# EasyEDA Pro project remap_2025-11-01.epro

# Schematic remap
Board Name: remap; Create Date: 2025-10-31; Page Name: Sheet_1; Project Name: Makro; Schematic Name: remap; Update Date: 2025-10-31; File: Remapper; Id: /; Sheet: /
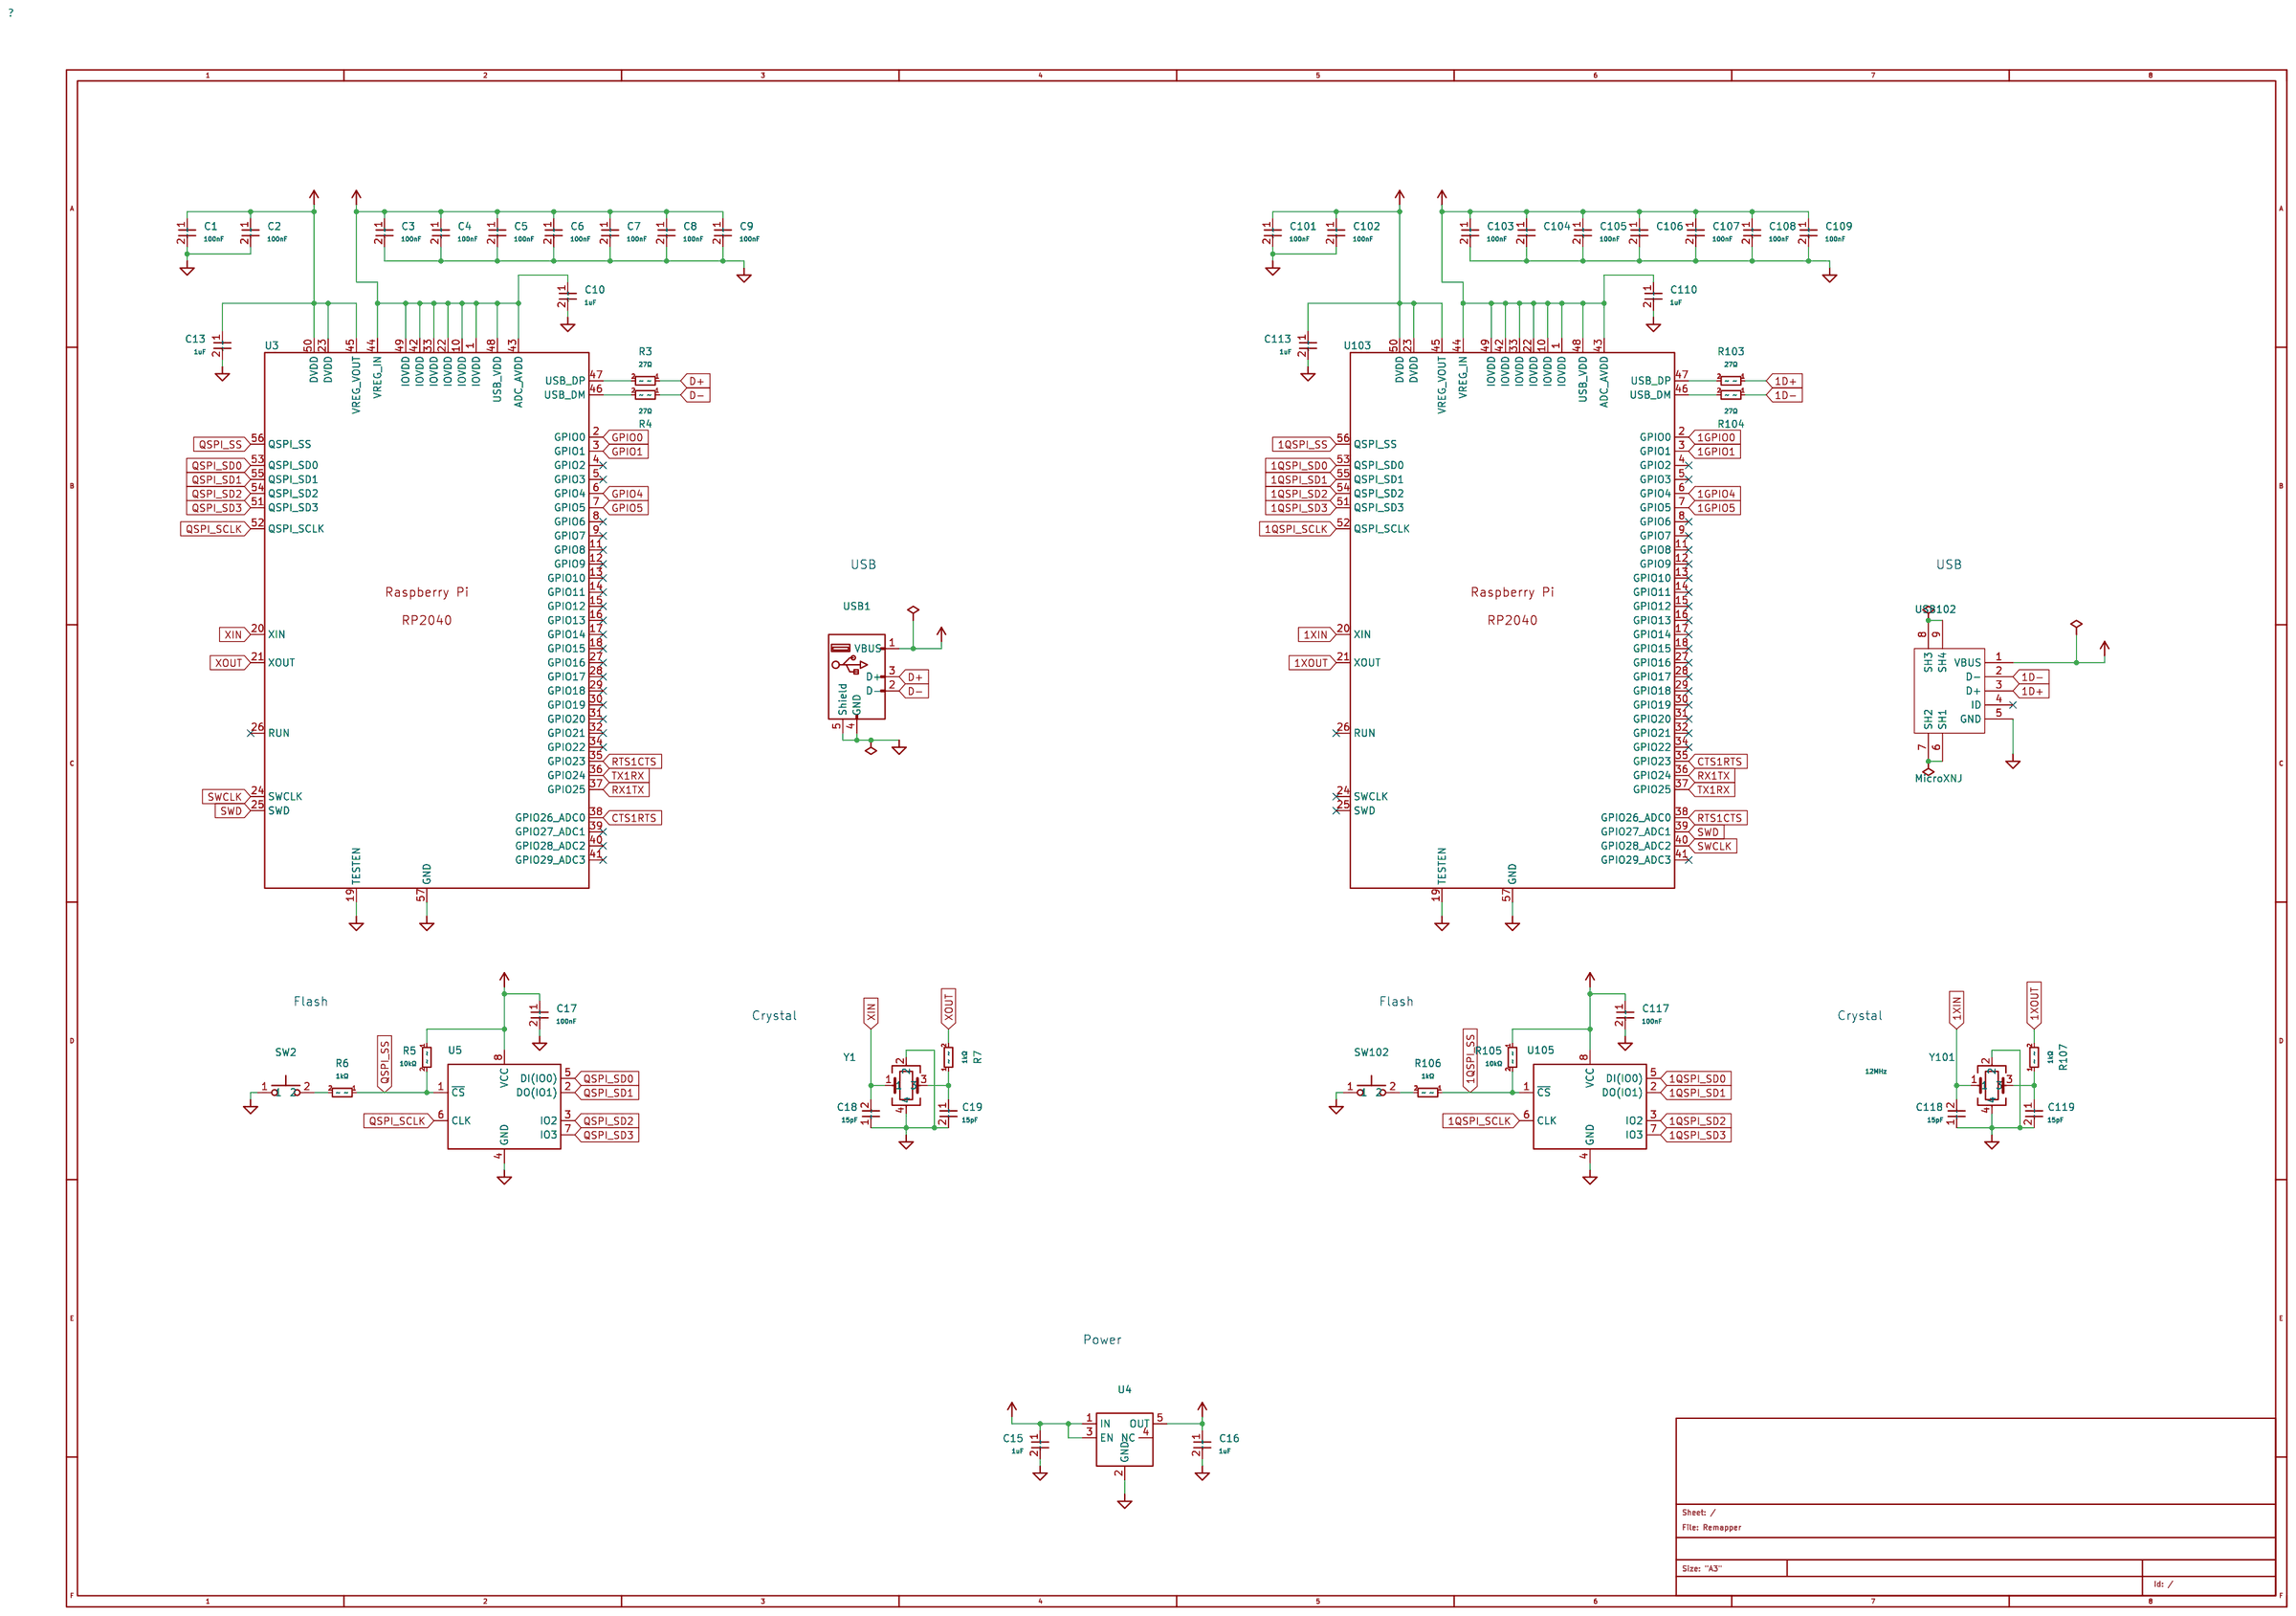
[diagram p0: schematic sheet]

## Parts
C1  100nF  [C0402]
C2  100nF  [C0402]
C3  100nF  [C0402]
C4  100nF  [C0402]
C5  100nF  [C0402]
C6  100nF  [C0402]
C7  100nF  [C0402]
C8  100nF  [C0402]
C9  100nF  [C0402]
C10  1uF  [C0402]
C13  1uF  [C0402]
C15  1uF  [C0402]
C16  1uF  [C0402]
C17  100nF  [C0402]
C18  15pF  [C0402]
C19  15pF  [C0402]
C101  100nF  [C0402]
C102  100nF  [C0402]
C103  100nF  [C0402]
C104  100nF  [C0402]
C105  100nF  [C0402]
C106  100nF  [C0402]
C107  100nF  [C0402]
C108  100nF  [C0402]
C109  100nF  [C0402]
C110  1uF  [C0402]
C113  1uF  [C0402]
C117  100nF  [C0402]
C118  15pF  [C0402]
C119  15pF  [C0402]
R3  27Ω  [R0402]
R4  27Ω  [R0402]
R5  10kΩ  [R0402]
R6  1kΩ  [R0402]
R7  1kΩ  [R0402]
R103  27Ω  [R0402]
R104  27Ω  [R0402]
R105  10kΩ  [R0402]
R106  1kΩ  [R0402]
R107  1kΩ  [R0402]
SW2  B3U-1000P  [KEY-SMD_B3U-1000PM]
SW102  B3U-1000P  [KEY-SMD_B3U-1000PM]
U3  RP2040  [LQFN-56_L7.0-W7.0-P0.4-EP]
U4  TLV73333PDBVR  [SOT-23-5_L3.0-W1.7-P0.95-LS2.8-BR]
U5  W25Q16JVUXIQ  [USON-8_L3.0-W2.0-P0.50-BL-EP]
U103  RP2040  [LQFN-56_L7.0-W7.0-P0.4-EP]
U105  W25Q16JVUXIQ  [USON-8_L3.0-W2.0-P0.50-BL-EP]
USB1  U-USBAR04P-F002  [USB-A-TH_USB-302-T]
USB102  MicroXNJ  [MICRO-USB-SMD_MICROXNJ]
Y1  12MHz  [CRYSTAL-SMD_4P-L2.5-W2.0-BL-A]
Y101  12MHz  [CRYSTAL-SMD_4P-L2.5-W2.0-BL-A]

## Library data of the parts
C1-C9 C17 C101-C109 C117 = CL05B104KO5NNNC: Capacitance:100nF Tolerance:±10% Tolerance:±10% Voltage Rating:16V Temperature Coefficient:X7R; LCSC Part Name: 100nF ±10% 16V; Supplier Part: C1525; Manufacturer: SAMSUNG(三星); Supplier Footprint: 0402; JLCPCB Part Class: Basic Part; Datasheet: https://atta.szlcsc.com/upload/public/pdf/source/20160218/1457707763339.pdf; Supplier: LCSC; Tolerance: ±10%; Temperature Coefficient: X7R; Voltage Rating: 16V
C10 C13 C15 C16 C110 C113 = CL05A105KA5NQNC: Capacitance:1uF Tolerance:±10% Tolerance:±10% Voltage Rating:25V Temperature Coefficient:X5R; LCSC Part Name: 1uF ±10% 25V; Supplier Part: C52923; Manufacturer: SAMSUNG(三星); Supplier Footprint: 0402; JLCPCB Part Class: Basic Part; Datasheet: https://atta.szlcsc.com/upload/public/pdf/source/20160218/1457707763339.pdf; Supplier: LCSC; Tolerance: ±10%; Temperature Coefficient: X5R; Voltage Rating: 25V
C18 C19 C118 C119 = 0402CG150J500NT: Capacitance:15pF Tolerance:±5% Tolerance:±5% Voltage Rating:50V Temperature Coefficient:C0G; LCSC Part Name: 15pF ±5% 50V; Supplier Part: C1548; Manufacturer: FH(风华); Supplier Footprint: 0402; JLCPCB Part Class: Basic Part; Datasheet: https://atta.szlcsc.com/upload/public/pdf/source/20200305/C486355_26A10D38EF8C2A5C37091D0039909270.pdf; Supplier: LCSC; Tolerance: ±5%; Temperature Coefficient: C0G; Voltage Rating: 50V
R3 R4 R103 R104 = RC0402FR-0727RL: Type:Thick Film Resistor Resistance:27Ω Tolerance:±1% Tolerance:±1% Power(Watts):62.5mW Voltage-Supply(Max):50V Temperature Coefficient:±100ppm/℃ Temperature Coefficient:±100ppm/℃ Operating Temperature:-55℃~+155℃ Operating Temperature:-55℃~+155℃; LCSC Part Name: 厚膜电阻 27Ω ±1% 62.5mW; Supplier Part: C138021; Manufacturer: YAGEO(国巨); Supplier Footprint: 0402; JLCPCB Part Class: Extended Part; Datasheet: https://atta.szlcsc.com/upload/public/pdf/source/20181009/C309620_DA5935B6E1D48212CB7A533FE518B3C2.pdf; Supplier: LCSC; Type: Thick Film Resistors; Tolerance: ±1%; Power(Watts): 62.5mW; Temperature Coefficient: ±100ppm/℃; Operating Temperature Range: -55℃~+155℃; Voltage-Supply(Max): 50V; Operating Temperature: -55℃~+155℃
R5 R105 = 0402WGF1002TCE: Type:Thick Film Resistor Resistance:10kΩ Tolerance:±1% Tolerance:±1% Power(Watts):62.5mW Voltage-Supply(Max):50V Temperature Coefficient:±100ppm/℃ Temperature Coefficient:±100ppm/℃ Operating Temperature:-55℃~+155℃ Operating Temperature:-55℃~+155℃; LCSC Part Name: 10kΩ ±1% 62.5mW 厚膜电阻; Supplier Part: C25744; Manufacturer: UNI-ROYAL(厚声); Supplier Footprint: 0402; JLCPCB Part Class: Basic Part; Datasheet: https://atta.szlcsc.com/upload/public/pdf/source/20200306/C422600_1E6D84923E4A46A82E41ADD87F860B5C.pdf; Supplier: LCSC; Type: Thick Film Resistors; Tolerance: ±1%; Power(Watts): 62.5mW; Temperature Coefficient: ±100ppm/℃; Operating Temperature Range: -55℃~+155℃; Voltage-Supply(Max): 50V; Operating Temperature: -55℃~+155℃
R6 R7 R106 R107 = 0402WGF1001TCE: Type:Thick Film Resistor Resistance:1kΩ Tolerance:±1% Tolerance:±1% Power(Watts):62.5mW Voltage-Supply(Max):50V Temperature Coefficient:±100ppm/℃ Temperature Coefficient:±100ppm/℃ Operating Temperature:-55℃~+155℃ Operating Temperature:-55℃~+155℃; LCSC Part Name: 1kΩ ±1% 62.5mW 厚膜电阻; Supplier Part: C11702; Manufacturer: UNI-ROYAL(厚声); Supplier Footprint: 0402; JLCPCB Part Class: Basic Part; Datasheet: https://atta.szlcsc.com/upload/public/pdf/source/20200306/C422600_1E6D84923E4A46A82E41ADD87F860B5C.pdf; Supplier: LCSC; Type: Thick Film Resistors; Tolerance: ±1%; Power(Watts): 62.5mW; Temperature Coefficient: ±100ppm/℃; Operating Temperature Range: -55℃~+155℃; Voltage-Supply(Max): 50V; Operating Temperature: -55℃~+155℃
SW2 SW102 = B3U-1000P_C231329: Circuit:SPST Actuator Style:Round Button Operating Force:1.53N Mounting Type:Surface Mount,Vertical Length:3mm Width:2.5mm Switch Height:1.6mm Contact Current:50mA Voltage Rating:12V With Lamp:- Termination Style:SMD(SMT) Tab Life:- Operating Temperature:; LCSC Part Name: 3*2.5*1.6mm 立贴 轻触开关; Supplier Part: C231329; Manufacturer: OMRON(欧姆龙); Supplier Footprint: SMD,2.5x3mm; JLCPCB Part Class: Extended Part; Datasheet: https://item.szlcsc.com/datasheet/B3U-1000P/231216.html; Supplier: LCSC; Circuit: SPST; Actuator Style: Round Button; Operating Force: 153gf; Mounting Style: Standing paste; Switch Length: 3mm; Switch Width: 2.5mm; Switch Height: 1.6mm; Contact Current: 50mA; Voltage Rating (DC): 12V; Pin Style: SMDSplicing; Operating Temperature: -25℃~+70℃; Mounting Type: Surface Mount,Vertical; Length: 3mm; Width: 2.5mm; Voltage Rating: 12V; Termination Style: SMD(SMT) Tab
U3 U103 = RP2040_C2040: CPU Core:- CPU Maximum Speed:133MHz Number of I/O:30 ADC (Bit):12bit Applications:-; LCSC Part Name: RP2040（RP2B2）; Supplier Part: C2040; Manufacturer: Raspberry Pi(树莓派); Supplier Footprint: LQFN-56(7x7); JLCPCB Part Class: Extended Part; Datasheet: https://atta.szlcsc.com/upload/public/pdf/source/20210621/C2040_96F425825606B7957D87DD32E2512CA9.pdf; Supplier: LCSC; CPU Maximum Speed: 133MHz; Number of I/O: 30; ADC (Bit): 12bit
U4 = TLV73333PDBVR: Output Type:Fixed Voltage - Supply:5.5V Output Voltage:3.3V Output Voltage:3.3V Output Current:300mA Power Supply Rejection Ratio (PSRR):50dB@(1kHz) Voltage Dropout:125mV@(300mA) standby current:34uA Noise:28uVrms Features:Under Voltage Lockout；Over Curre; LCSC Part Name: 具有使能功能的 300mA、低 IQ、低压降无电容稳压器; Supplier Part: C134139; Manufacturer: TI(德州仪器); Supplier Footprint: SOT-23-5; JLCPCB Part Class: Extended Part; Datasheet: https://www.ti.com/cn/lit/gpn/tlv733p; Supplier: LCSC; Output Type: Fixed; Maximum Input Voltage: 5.5V; Output Voltage: 3.3V; Output Current: 300mA; Power Supply Rejection Ratio (PSRR): 68dB@(100Hz)；28dB@(100kHz); Dropout Voltage: 270mV@(300mA); standby current: 60uA; Feature: ESD Protection；Surge Protection；Automatic Discharge Function；Low ESR；Thermal Protection(TSD)；Under-voltage Lockout；Overcurrent Protection(OCP)；With ability；Anti-Siphon; Operating Temperature: -40℃~+125℃@(Tj); Output Polarity: Positive electrode; Number of Outputs: 1; Voltage - Supply: 5.5V; Voltage Dropout: 125mV@(300mA); Noise: 28uVrms; Features: Under Voltage Lockout；Over Current Protection；Enable；Over Temperature Protection; Output Configuration: Positive
U5 U105 = W25Q16JVUXIQ: Interface:SPI Memory Size:16Mbit Clock Frequency:133MHz Voltage - Supply:2.7V~3.6V Voltage - Supply:2.7V~3.6V Program / Erase Cycles:100,000 Cycles Page Programming Time (Tpp):3ms Data Retention - TDR (Year):20 Years; Supplier Part: C2843335; Manufacturer: Winbond(华邦); Supplier Footprint: USON-8-EP(2x3); JLCPCB Part Class: Extended Part; Datasheet: https://atta.szlcsc.com/upload/public/pdf/source/20210629/C2843335_FB4D78B5076715625DC0C83F790D3044.pdf; Supplier: LCSC; Interface: SPI; Memory Size: 16Mbit; Clock Frequency: 133MHz; Voltage - Supply: 2.7V~3.6V; Program / Erase Cycles: 100,000 Cycles; Page Programming Time (Tpp): 3ms; Data Retention - TDR (Year): 20 Years
USB1 = U-USBAR04P-F002: Connector Type:Type-A Protocol Standard:USB 2.0 Gender:Female Mounting Type:Right Angle Number of Contacts:4P Number of Ports:1 Current Rating-Power:1.5A Operating Temperature:0℃~+50℃ Operating Temperature:0℃~+50℃; LCSC Part Name: Type-A 母 弯插; Supplier Part: C386736; Manufacturer: Ckmtw(灿科盟); Supplier Footprint: 插件; JLCPCB Part Class: Extended Part; Datasheet: https://item.szlcsc.com/datasheet/U-USBAR04P-F002/360843.html; Supplier: LCSC; Connector Type: Type-A; Protocol Standard: USB 2.0; Gender: Female; Mounting Type: Right Angle; Number of Contacts: 4P; Number of Ports: 1; Current Rating-Power: 1.5A; Operating Temperature: 0℃~+50℃
USB102 = MicroXNJ: Connector Type:Micro-B Standard:USB 2.0 Gender:Female Mounting Style:Horizontal attachment Number of Contacts:5P Number of Ports:1 Current Rating - Power (Max):1.8A Operating Temperature Range:-20℃~+85℃ Operating Temperature Range:-20℃~+85℃ Rated Voltage; LCSC Part Name: Micro-B 母 卧贴; Supplier Part: C404969; Manufacturer: SHOU HAN(首韩); Supplier Footprint: SMD; JLCPCB Part Class: Extended Part; Datasheet: https://atta.szlcsc.com/upload/public/pdf/source/20220415/2494EDFF499AF6F852F7C820374B6AF3.pdf; Supplier: LCSC; Connector Type: Micro-B; Standard: USB 2.0; Gender: Female; Mounting Style: Horizontal attachment; Number of Contacts: 5P; Number of Ports: 1; Current Rating - Power (Max): 1.8A; Operating Temperature Range: -20℃~+85℃; Rated Voltage (Max): 30V; Connect-Disconnect Life: 5000 Cuts; Core Colour: Black
Y1 Y101 = X252012MMB4SI-24: Type:Crystal Oscillator Frequency:12MHz Normal temperature Frequency Tolerance:±10ppm Normal temperature Frequency Tolerance:±10ppm Load Capacitance:10pF Frequency Stability:±20ppm Frequency Stability:±20ppm Operating Temperature:-40℃~+85℃ Operating Tempe; LCSC Part Name: YSX221SL 12MHZ 4P 2520 10PF ±10PPM -40~85℃ (±20PPM); Supplier Part: C2896601; Manufacturer: YXC(扬兴晶振); Supplier Footprint: SMD2520-4P; JLCPCB Part Class: Extended Part; Datasheet: https://atta.szlcsc.com/upload/public/pdf/source/20240329/8B53C0AFBC5BB264DFB5D72B3757797A.pdf; Supplier: LCSC; Type: Surface Mount Crystal; Normal temperature Frequency Tolerance: ±10ppm; Load Capacitance: 10pF; Frequency Stability: ±20ppm; Operating Temperature: -40℃~+85℃

## Nets
+1V1: C1.1 C2.1 C13.1 U3.23(DVDD) U3.45(VREG_VOUT) U3.50(DVDD)
+1V2: C101.1 C102.1 C113.1 U103.23(DVDD) U103.45(VREG_VOUT) U103.50(DVDD)
+3V3: C3.1 C4.1 C5.1 C6.1 C7.1 C8.1 C9.1 C10.1 C16.1 C17.1 C103.1 C104.1 C105.1 C106.1 C107.1 C108.1 C109.1 C110.1 C117.1 R5.1 R105.1 U3.1(IOVDD) U3.10(IOVDD) U3.22(IOVDD) U3.33(IOVDD) U3.42(IOVDD) U3.43(ADC_AVDD) U3.44(VREG_IN) U3.48(USB_VDD) U3.49(IOVDD) U4.5(OUT) U5.8(VCC) U103.1(IOVDD) U103.10(IOVDD) U103.22(IOVDD) U103.33(IOVDD) U103.42(IOVDD) U103.43(ADC_AVDD) U103.44(VREG_IN) U103.48(USB_VDD) U103.49(IOVDD) U105.8(VCC)
+5V: C15.1 U4.1(IN) U4.3(EN) USB1.1(VBUS) USB102.1(VBUS)
GND: C1.2 C2.2 C3.2 C4.2 C5.2 C6.2 C7.2 C8.2 C9.2 C10.2 C13.2 C15.2 C16.2 C17.2 C18.1 C19.2 C101.2 C102.2 C103.2 C104.2 C105.2 C106.2 C107.2 C108.2 C109.2 C110.2 C113.2 C117.2 C118.1 C119.2 SW2.1 SW102.1 U3.19(TESTEN) U3.57(GND) U4.2(GND) U5.4(GND) U103.19(TESTEN) U103.57(GND) U105.4(GND) USB1.4(GND) USB1.5(Shield) USB102.5(GND) USB102.6(SH1) USB102.7(SH2) USB102.8(SH3) USB102.9(SH4) Y1.2 Y1.4 Y101.2 Y101.4
1D+: R103.1 USB102.3(D+)
1D-: R104.1 USB102.2(D-)
1GPIO0: U103.2(GPIO0)
1GPIO1: U103.3(GPIO1)
1GPIO4: U103.6(GPIO4)
1GPIO5: U103.7(GPIO5)
1QSPI_SCLK: U103.52(QSPI_SCLK) U105.6(CLK)
1QSPI_SD0: U103.53(QSPI_SD0) U105.5(DI(IO0))
1QSPI_SD1: U103.55(QSPI_SD1) U105.2(DO(IO1))
1QSPI_SD2: U103.54(QSPI_SD2) U105.3(IO2)
1QSPI_SD3: U103.51(QSPI_SD3) U105.7(IO3)
1QSPI_SS: R105.2 R106.1 U103.56(QSPI_SS) U105.1(~{CS})
1XIN: C118.2 U103.20(XIN) Y101.1
1XOUT: R107.2 U103.21(XOUT)
CTS1RTS: U3.38(GPIO26_ADC0) U103.35(GPIO23)
D+: R3.1 USB1.3(D+)
D-: R4.1 USB1.2(D-)
GPIO0: U3.2(GPIO0)
GPIO1: U3.3(GPIO1)
GPIO4: U3.6(GPIO4)
GPIO5: U3.7(GPIO5)
QSPI_SCLK: U3.52(QSPI_SCLK) U5.6(CLK)
QSPI_SD0: U3.53(QSPI_SD0) U5.5(DI(IO0))
QSPI_SD1: U3.55(QSPI_SD1) U5.2(DO(IO1))
QSPI_SD2: U3.54(QSPI_SD2) U5.3(IO2)
QSPI_SD3: U3.51(QSPI_SD3) U5.7(IO3)
QSPI_SS: R5.2 R6.1 U3.56(QSPI_SS) U5.1(~{CS})
RTS1CTS: U3.35(GPIO23) U103.38(GPIO26_ADC0)
RX1TX: U3.37(GPIO25) U103.36(GPIO24)
SWCLK: U3.24(SWCLK) U103.40(GPIO28_ADC2)
SWD: U3.25(SWD) U103.39(GPIO27_ADC1)
TX1RX: U3.36(GPIO24) U103.37(GPIO25)
XIN: C18.2 U3.20(XIN) Y1.1
XOUT: R7.2 U3.21(XOUT)
$C19_1: C19.1 R7.1 Y1.3
$C119_1: C119.1 R107.1 Y101.3
$R3_2: R3.2 U3.47(USB_DP)
$R4_2: R4.2 U3.46(USB_DM)
$R6_2: R6.2 SW2.2
$R103_2: R103.2 U103.47(USB_DP)
$R104_2: R104.2 U103.46(USB_DM)
$R106_2: R106.2 SW102.2

Not connected (* = marked no-connect by the designer): U3 4(GPIO2)* 5(GPIO3)* 8(GPIO6)* 9(GPIO7)* 11(GPIO8)* 12(GPIO9)* 13(GPIO10)* 14(GPIO11)* 15(GPIO12)* 16(GPIO13)* 17(GPIO14)* 18(GPIO15)* 26(RUN)* 27(GPIO16)* 28(GPIO17)* 29(GPIO18)* 30(GPIO19)* 31(GPIO20)* 32(GPIO21)* 34(GPIO22)* 39(GPIO27_ADC1)* 40(GPIO28_ADC2)* 41(GPIO29_ADC3)*; U4 4(NC); U103 4(GPIO2)* 5(GPIO3)* 8(GPIO6)* 9(GPIO7)* 11(GPIO8)* 12(GPIO9)* 13(GPIO10)* 14(GPIO11)* 15(GPIO12)* 16(GPIO13)* 17(GPIO14)* 18(GPIO15)* 24(SWCLK)* 25(SWD)* 26(RUN)* 27(GPIO16)* 28(GPIO17)* 29(GPIO18)* 30(GPIO19)* 31(GPIO20)* 32(GPIO21)* 34(GPIO22)* 41(GPIO29_ADC3)*; USB102 4(ID)*

## Notes on the sheet
- USB
- USB
- Flash
- Flash
- Crystal
- Crystal
- Power

# Board remap
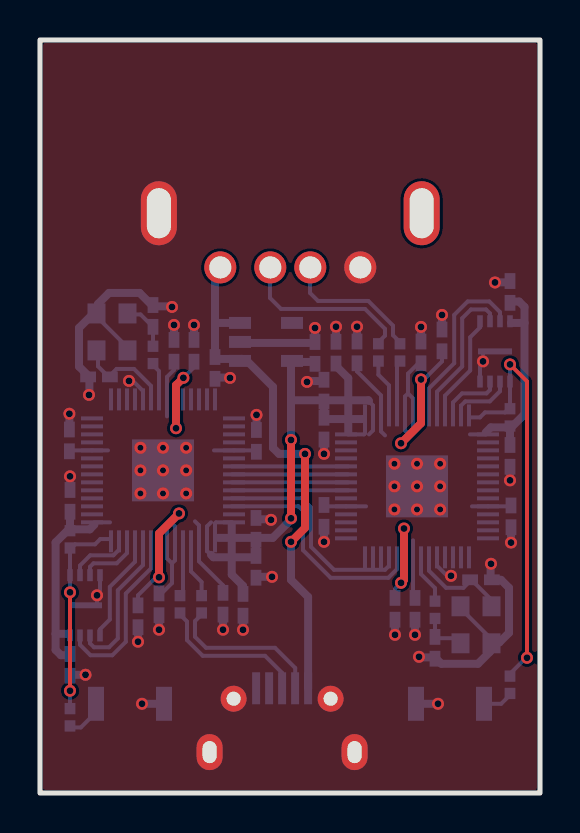
[diagram p1: board, top side]
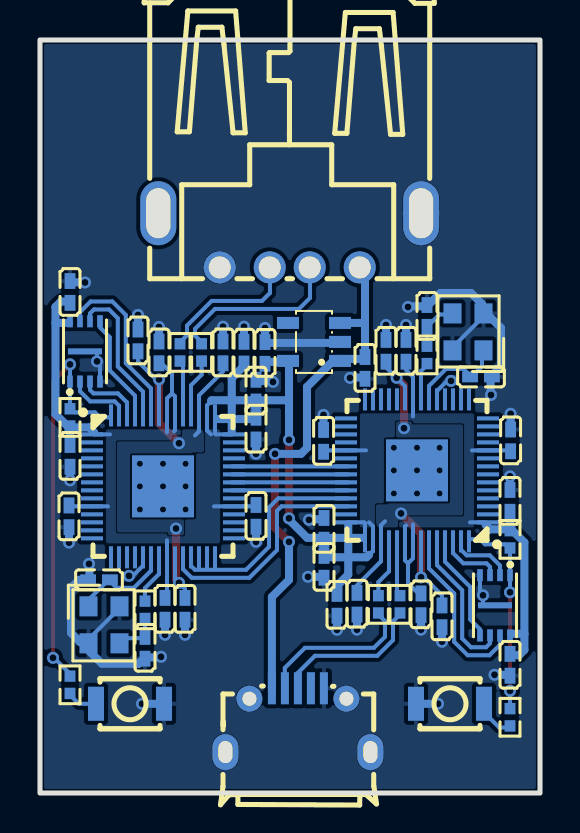
[diagram p2: board, bottom side, seen from below]

Outline 25 x 37.67 mm; copper layers: Top Layer, Bottom Layer. Coordinates in mm from the lower left corner of the outline.
Outline path: rectangle 0,37.67 25,0
Stack: Top Layer 0.0009mm / dielectric 1 0.0384mm FR4 er 4.5 / Bottom Layer 0.0009mm

## Design rules (mm)
spacing safeClearance (default): track to track 0, other pairs 0 to 0.2
track width trackWidth (default): min 0.127, default 0.254, max 2.54
differential pair differentialPair (default): width min 0.127, default 0.254, max 2.54; gap min 0.152, default 0.152
via viaSize (default): diameter min 0.5, default 0.61, max 10; hole min 0.3, default 0.305, max 6
net GND uses CopperRegion4
net +1V2 uses CopperRegion2
net +3V3 uses CopperRegion3
net +1V1 uses CopperRegion1
pour ie1056 uses CopperRegion1
pour ie1057 uses CopperRegion2
pour ie1058 uses CopperRegion
pour ie1059 uses CopperRegion3

## Placement (name value [footprint] x y rotation side)
C1  100nF  [C0402]  20.1 22.64 90 bottom
C2  100nF  [C0402]  17.75 9.21 270 bottom
C3  100nF  [C0402]  19.05 22.04 90 bottom
C4  100nF  [C0402]  23.5 16.86 270 bottom
C5  100nF  [C0402]  14.2 13.86 270 bottom
C6  100nF  [C0402]  23.55 13.84 270 bottom
C7  100nF  [C0402]  18.75 9.21 270 bottom
C8  100nF  [C0402]  14.2 18.23 270 bottom
C9  100nF  [C0402]  14.2 20.13 90 bottom
C10  1uF  [C0402]  14.8 22.03 90 bottom
C13  1uF  [C0402]  15.85 22.04 90 bottom
C15  1uF  [C0402]  8.75 21.26 270 bottom
C16  1uF  [C0402]  13.75 22.01 90 bottom
C17  100nF  [C0402]  23.5 25.06 90 bottom
C18  15pF  [C0402]  22.05 10.66 180 bottom
C19  15pF  [C0402]  19.75 7.26 270 bottom
C101  100nF  [C0402]  4.9 8.84 270 bottom
C102  100nF  [C0402]  7.7 22.12 90 bottom
C103  100nF  [C0402]  5.95 9.44 270 bottom
C104  100nF  [C0402]  1.5 14.61 90 bottom
C105  100nF  [C0402]  10.82 17.61 90 bottom
C106  100nF  [C0402]  1.47 17.64 90 bottom
C107  100nF  [C0402]  6.7 22.12 90 bottom
C108  100nF  [C0402]  10.8 13.21 90 bottom
C109  100nF  [C0402]  10.8 11.31 270 bottom
C110  1uF  [C0402]  10.15 9.41 270 bottom
C113  1uF  [C0402]  9.15 9.47 270 bottom
C117  100nF  [C0402]  1.5 6.41 270 bottom
C118  15pF  [C0402]  2.95 20.81 0 bottom
C119  15pF  [C0402]  5.65 23.86 90 bottom
R3  27Ω  [R0402]  18 22.04 270 bottom
R4  27Ω  [R0402]  16.92 22.04 270 bottom
R5  10kΩ  [R0402]  23.5 18.79 90 bottom
R6  1kΩ  [R0402]  23.5 5.41 270 bottom
R7  1kΩ  [R0402]  19.75 9.16 90 bottom
R103  27Ω  [R0402]  7 9.44 90 bottom
R104  27Ω  [R0402]  8.08 9.44 90 bottom
R105  10kΩ  [R0402]  1.5 12.69 270 bottom
R106  1kΩ  [R0402]  1.5 3.79 270 bottom
R107  1kΩ  [R0402]  5.65 21.91 270 bottom
SW2  B3U-1000P  [KEY-SMD_B3U-1000PM]  20.5 4.46 0 bottom
SW102  B3U-1000P  [KEY-SMD_B3U-1000PM]  4.5 4.46 180 bottom
U3  RP2040  [LQFN-56_L7.0-W7.0-P0.4-EP]  18.85 15.34 180 bottom
U4  TLV73333PDBVR  [SOT-23-5_L3.0-W1.7-P0.95-LS2.8-BR]  11.3 22.56 180 bottom
U5  W25Q16JVUXIQ  [USON-8_L3.0-W2.0-P0.50-BL-EP]  22.75 22.09 180 bottom
U103  RP2040  [LQFN-56_L7.0-W7.0-P0.4-EP]  6.15 16.14 0 bottom
U105  W25Q16JVUXIQ  [USON-8_L3.0-W2.0-P0.50-BL-EP]  2.25 9.39 0 bottom
USB1  U-USBAR04P-F002  [USB-A-TH_USB-302-T]  12.51 27.65 0 bottom
USB102  MicroXNJ  [MICRO-USB-SMD_MICROXNJ]  12.1 3.64 180 bottom
Y1  12MHz  [CRYSTAL-SMD_4P-L2.5-W2.0-BL-A]  21.8 8.41 270 bottom
Y101  12MHz  [CRYSTAL-SMD_4P-L2.5-W2.0-BL-A]  3.6 23.06 90 bottom

## Footprints (pads in the part's own frame, mm; a bottom-side part is the same pattern mirrored in y, then rotated)
C0402
  rect 0.79x0.54 smd: 1(-0.545,0) 2(0.545,0)
CRYSTAL-SMD_4P-L2.5-W2.0-BL-A
  rect 1x0.9 smd: 1(-0.925,-0.775) 2(0.925,-0.775) 3(0.925,0.775) 4(-0.925,0.775)
KEY-SMD_B3U-1000PM
  rect 0.8x1.7 smd: 1(-1.7,0) 2(1.7,0)
LQFN-56_L7.0-W7.0-P0.4-EP
  rect 1.1x0.2 smd: 1(-3.55,2.6) 2(-3.55,2.2) 3(-3.55,1.8) 4(-3.55,1.4) 5(-3.55,1) 6(-3.55,0.6) 7(-3.55,0.2) 8(-3.55,-0.2) 9(-3.55,-0.6) 10(-3.55,-1) 11(-3.55,-1.4) 12(-3.55,-1.8) 13(-3.55,-2.2) 14(-3.55,-2.6) 29(3.55,-2.6) 30(3.55,-2.2) 31(3.55,-1.8) 32(3.55,-1.4) 33(3.55,-1) 34(3.55,-0.6) 35(3.55,-0.2) 36(3.55,0.2) 37(3.55,0.6) 38(3.55,1) 39(3.55,1.4) 40(3.55,1.8) 41(3.55,2.2) 42(3.55,2.6)
  rect 0.2x1.1 smd: 15(-2.6,-3.55) 16(-2.2,-3.55) 17(-1.8,-3.55) 18(-1.4,-3.55) 19(-1,-3.55) 20(-0.6,-3.55) 21(-0.2,-3.55) 22(0.2,-3.55) 23(0.6,-3.55) 24(1,-3.55) 25(1.4,-3.55) 26(1.8,-3.55) 27(2.2,-3.55) 28(2.6,-3.55) 43(2.6,3.55) 44(2.2,3.55) 45(1.8,3.55) 46(1.4,3.55) 47(1,3.55) 48(0.6,3.55) 49(0.2,3.55) 50(-0.2,3.55) 51(-0.6,3.55) 52(-1,3.55) 53(-1.4,3.55) 54(-1.8,3.55) 55(-2.2,3.55) 56(-2.6,3.55)
  rect 3.1x3.1 smd: 57(0,0)
MICRO-USB-SMD_MICROXNJ
  rect 0.4x1.6 smd: 1(-1.3,1.597) 2(-0.65,1.597) 3(0,1.597) 4(0.65,1.597) 5(1.3,1.597)
  round 1.3 hole 0.7: 6(2.425,1.074) 9(-2.425,1.073)
  oval 1.3x1.8 hole 0.7x1.1: 7(3.625,-1.597) 8(-3.625,-1.597)
R0402
  rect 0.566x0.54 smd: 1(-0.433,0) 2(0.433,0)
SOT-23-5_L3.0-W1.7-P0.95-LS2.8-BR
  rect 1.1x0.6 smd: 1(1.3,-0.95) 2(1.3,0) 3(1.3,0.95) 4(-1.3,0.95) 5(-1.3,-0.95)
USB-A-TH_USB-302-T
  round 1.6 hole 1.1: 1(-3.5,1.355) 2(-1,1.355) 3(1,1.355) 4(3.5,1.355)
  oval 1.8x3.2 hole 1.2x2.5: 5(-6.57,-1.355) 6(6.57,-1.355)
USON-8_L3.0-W2.0-P0.50-BL-EP
  rect 0.28x0.6 smd: 1(-0.75,-1.508) 2(-0.25,-1.508) 3(0.25,-1.508) 4(0.75,-1.508) 5(0.75,1.508) 6(0.25,1.508) 7(-0.25,1.508) 8(-0.75,1.508)
  rect 1.7x0.3 smd: 9(0,0)

## Nets
As in the schematic.

Pads without a net: U3 4 5 8 9 11 12 13 14 15 16 17 18 26 27 28 29 30 31 32 34 39 40 41; U4 4; U5 9; U103 4 5 8 9 11 12 13 14 15 16 17 18 24 25 26 27 28 29 30 31 32 34 41; U105 9; USB1 6; USB102 4

## Via types
v1: diameter 0.6, hole 0.35, Top Layer to Bottom Layer, 52 vias
v2: diameter 0.61, hole 0.305, Top Layer to Bottom Layer, 18 vias

## Routing (per net, layer and track width the routed paths; a pad name or vN(x,y) marks a point on that pad's centre or on a via; arc(x,y) is an arc through that point)
+1V1: length 17
  Top Layer w0.4: v1(18.05,17.49) 19.05,18.49 v1(19.05,20.69) ; v1(18.2,13.23) 18.2,10.66 v1(18.05,10.51)
  Bottom Layer w0.2: 15.85,21.56 15.85,21.09 17.05,19.89 U3.45 17.05,18.09 17.25,17.89 ; 19.05,18.78 v1(19.05,20.69) 19.2,20.69 20.1,21.59 20.1,22.16 ; 18.25,11.9 18.25,10.71 v1(18.05,10.51) 17.75,10.21 17.75,9.69
+1V2: length 16.9
  Top Layer w0.4: v1(6.8,18.25) 6.8,20.4 v1(7.17,20.77) ; 5.95,10.78 5.95,12.98 6.95,13.98
  Bottom Layer w0.2: 6.75,19.58 6.75,20.35 v1(7.17,20.77) 7.7,21.3 7.7,21.64 ; 7.75,13.59 7.95,13.39 U103.45 7.95,11.59 9.15,10.39 9.15,9.95 ; 5.95,12.7 v1(5.95,10.79) 5.8,10.79 4.9,9.89 4.9,9.32
  vias: v1(6.95,13.98)
+3V3: length 85.6
  Top Layer w0.4: v1(12.55,17.66) v1(12.55,13.74)
  Bottom Layer w0.2: 16.45,17.94 16.65,18.14 16.65,19.39 16.45,19.59 ; 10.82,17.13 10.81,17.14 U103.33 8.7,17.14 ; 18.3,18.09 18.25,18.14 U3.48 18.25,19.84 18.4,19.99 ; 23.55,14.32 23.53,14.34 U3.10 21.6,14.34 ; 2.71,13.54 3.5,13.54 ; 6.7,13.39 6.75,13.34 U103.48 6.75,11.64 6.6,11.49 ; 6.35,18.84 U103.22 6.35,20.81 6.7,21.16 6.7,21.64 ; 8.75,12.7 8.75,13.49 8.8,13.54 9.59,13.54 ; 15.41,17.94 16.2,17.94 16.25,17.99 16.25,18.78 ; 6.6,11.49 6.6,10.5 6.02,9.92 5.95,9.92 ; 6.6,11.49 6.35,11.74 U103.49 6.35,13.44 ; 18.4,19.99 18.65,19.74 U3.49 18.65,18.04 ; 18.4,19.99 18.4,20.98 18.98,21.56 19.05,21.56 ; 1.47,17.16 1.49,17.14 U103.10 3.4,17.14 ; 14.2,14.34 14.21,14.34 U3.33 16.3,14.34 ; 8.55,13.54 8.35,13.34 8.35,12.09 ; 8.36,12.1 8.55,11.91 ; 18.75,9.69 18.65,9.79 U3.22 18.65,12.64 ; 22.29,17.94 21.5,17.94
  Bottom Layer w0.4: 10.8,12.73 10.8,11.79 9.59,11.79 ; 10.8,12.73 10.77,12.76 9.59,12.76 ; 10.8,12.73 10.83,12.76 11.64,12.76 12.55,13.67 v1(12.55,13.74) ; 8.55,11.91 8.67,11.79 9.59,11.79 ; 10.15,9.89 10.15,10.36 9.59,10.93 9.59,11.79 ; 23.5,18.28 23.56,18.28 24.22,18.95 24.22,23.51 ; 23.5,18.28 23.49,18.29 22.54,18.29 22.29,18.04 ; 23.5,18.28 23.5,17.34 ; 16.15,18.71 16.14,18.71 15.41,18.71 ; 9.59,12.76 9.59,13.44 ; 9.59,12.76 9.59,11.79 ; 9.59,12.76 8.9,12.76 ; 15.41,19.65 15.41,18.71 ; 15.41,19.65 15.41,20.75 14.8,21.36 14.8,21.55 ; 15.41,19.65 14.2,19.65 ; 15.41,19.65 16.42,19.65 16.45,19.61 ; 15.41,18.71 15.41,18.04 ; 15.41,18.71 14.2,18.71 14.2,19.65 ; 24.22,23.51 23.55,23.51 ; 24.22,23.51 24.22,24.31 23.96,24.58 23.5,24.58 ; 2.72,13.42 2.49,13.19 1.51,13.19 1.5,13.2 ; 0.78,7.96 0.78,7.16 1.04,6.89 1.5,6.89 ; 0.78,7.96 0.78,12.54 1.44,13.2 1.5,13.2 ; 0.78,7.96 1.45,7.96 ; 12.55,19.71 v1(12.55,17.66) ; 12.55,19.71 12.62,19.65 14.2,19.65 ; 12.55,19.71 12.55,21.46 12.45,21.56 ; 12.45,21.56 13.72,21.56 13.75,21.53 ; 12.45,21.56 12.4,21.61 ; 1.5,14.13 1.5,13.2
+5V: length 26.8
  Top Layer w0.4: v1(12.55,12.56) 13.25,13.26 v1(13.25,16.96)
  Bottom Layer w0.4: v1(12.55,12.56) 12.55,10.66 13.41,9.81 USB102.1 ; 9,26.31 8.75,26.06 8.75,23.61 ; v1(13.25,16.96) 11.95,16.96 11.65,17.26 11.65,20.31 10.35,21.61 10.2,21.61 10.1,21.71 8.78,21.71 8.75,21.74 8.75,23.61 ; 8.75,23.61 8.85,23.51 10.2,23.51
GND: length 56.3
  Bottom Layer w0.2: 4.3,22.19 4.3,22.36 2.9,23.76 2.9,23.94 ; 22.5,7.54 22.5,7.76 21.1,9.16 21.1,9.29 ; 5.15,19.58 5.15,20.11 4.64,20.61 v1(4.45,20.61) ; 22,20.66 22,21.44 v1(22.15,21.59) 22.15,22.09 ; 3,10.81 3,10.04 v1(2.85,9.89) 2.85,9.39 ; 19.85,11.9 19.85,11.37 20.36,10.86 v1(20.55,10.86)
  Bottom Layer w0.4: 10.8,13.69 11.52,13.69 v1(11.55,13.66) ; 4.9,8.36 v1(4.9,7.57) ; 10.2,22.56 10.25,22.51 13.73,22.51 13.75,22.49 v1(13.75,23.26) ; 1.5,15.09 v1(1.5,15.84) ; v1(2.28,5.91) 1.52,5.91 1.5,5.93 ; v1(23.55,12.53) 23.55,13.36 ; v1(6.7,23.41) 6.7,22.6 ; 23.5,25.54 22.75,25.54 v1(22.75,25.54) ; 14.8,22.51 v1(14.8,23.33) ; 9.15,8.99 v1(9.15,8.17) ; v1(1.47,18.97) 1.47,18.12 ; v1(11.6,10.81) 10.82,10.81 10.8,10.83 ; v1(10.15,8.16) 10.15,8.93 ; v1(17.75,7.91) 17.75,8.73 ; 20.1,23.12 v1(20.1,23.91) ; 23.5,16.38 v1(23.5,15.64) ; v1(9.5,20.76) 9.48,20.78 8.75,20.78 ; v1(2.45,19.91) 2.47,19.93 2.47,20.81 1.95,21.33 1.95,23.26 2.62,23.94 2.9,23.94 2.9,24.46 3.45,25.01 4.98,25.01 5.65,24.34 6.57,24.34 v1(6.6,24.31) ; 14.2,20.61 13.39,20.61 v1(13.35,20.56) ; v1(18.75,7.91) 18.75,8.73 ; 5.95,8.96 v1(5.95,8.17) ; v1(14.2,16.96) 14.2,17.75 ; v1(22.55,11.46) 22.53,11.44 22.53,10.66 23.05,10.66 23.45,10.26 23.45,8.01 22.97,7.54 22.5,7.54 22.5,7.06 21.9,6.46 20.07,6.46 19.75,6.78 18.98,6.78 v1(18.95,6.81) ; SW2.1 v1(19.9,4.46) ; v1(7.7,23.41) 7.7,22.6 ; v1(10.82,18.91) 10.82,18.1 10.82,18.09 ; SW102.1 v1(5.1,4.46) ; 19.05,22.52 v1(19.05,23.31) ; 15.85,22.52 v1(15.85,23.33) ; v1(14.2,12.56) 14.2,13.38
  vias: v2(5.02,17.27) v2(5.02,16.14) v2(5.02,14.98) v2(6.15,17.27) v2(6.15,16.14) v2(6.15,14.98) v2(7.31,17.27) v2(7.31,16.14) v2(7.31,14.98) v2(17.72,16.47) v2(17.72,15.34) v2(17.72,14.18) v2(18.85,16.47) v2(18.85,15.34) v2(18.85,14.18) v2(20.01,16.47) v2(20.01,15.34) v2(20.01,14.18)
1D+: length 7.6
  Bottom Layer w0.2: USB102.3 12.1,6.01 11.25,6.86 8.13,6.86 7.35,7.65 7.35,8.58 7,8.93
1D-: length 7.9
  Bottom Layer w0.2: 8.08,8.93 7.75,8.6 7.75,7.81 8.3,7.26 11.75,7.26 12.76,6.25 12.76,5.24 USB102.2
1QSPI_SCLK: length 7.6
  Bottom Layer w0.2: 5.15,12.7 5.15,11.4 3.89,10.14 3.89,7.73 3.45,7.29 2.7,7.29 2.5,7.49 2.5,7.96
1QSPI_SD0: length 5.5
  Bottom Layer w0.2: 3,7.96 3,8.19 3.49,8.68 3.49,10.31 4.75,11.57 4.75,12.7
1QSPI_SD1: length 3.4
  Bottom Layer w0.2: 2,10.81 2,11.38 2.51,11.89 3.67,11.89 3.95,12.17 3.95,12.7
1QSPI_SD2: length 3.3
  Bottom Layer w0.2: 2.5,10.81 2.5,11.31 2.68,11.49 3.83,11.49 4.35,12 4.35,12.7
1QSPI_SD3: length 9
  Bottom Layer w0.2: 5.55,12.7 5.55,11.24 4.29,9.98 4.29,7.56 3.62,6.89 2.53,6.89 2,7.41 2,7.96
1QSPI_SS: length 10.1
  Top Layer w0.2: v1(1.5,10.04) v1(1.5,5.11)
  Bottom Layer w0.2: v1(1.5,5.11) 1.5,4.3 ; v1(1.5,10.04) U105.1 1.5,12.18 1.76,12.44 2.75,12.44 3.01,12.7 3.55,12.7
1XIN: length 5
  Bottom Layer w0.2: 2.9,22.19 2.9,21.34 3.43,20.81 3.83,21.21 4.7,21.21 5.55,20.36 5.55,19.58
1XOUT: length 2
  Bottom Layer w0.2: 5.65,21.4 5.95,21.1 5.95,19.58
$C19_1: length 2.3
  Bottom Layer w0.2: 21.1,7.54 20.9,7.74 19.75,7.74 19.75,8.65
$C119_1: length 2.5
  Bottom Layer w0.2: 4.3,23.94 5.03,23.94 5.58,23.38 5.65,23.38 5.65,22.42
$R3_2: length 2.8
  Bottom Layer w0.2: 18,21.53 17.85,21.38 17.85,18.78
$R4_2: length 3
  Bottom Layer w0.2: 17.45,18.78 17.45,20.39 16.92,20.92 16.92,21.53
$R6_2: length 1.5
  Bottom Layer w0.2: SW2.2 23.06,4.46 23.5,4.9
$R103_2: length 2.8
  Bottom Layer w0.2: 7.15,12.7 7.15,10.1 7,9.95
$R104_2: length 3
  Bottom Layer w0.2: 8.08,9.95 8.08,10.55 7.55,11.08 7.55,12.7
$R106_2: length 2
  Bottom Layer w0.2: SW102.2 2.8,4.04 2.04,3.28 1.5,3.28
CTS1RTS: length 5.8
  Bottom Layer w0.2: 15.41,16.34 9.59,16.34
D+: length 7.1
  Bottom Layer w0.2: 18,22.55 17.65,22.9 17.65,23.38 16.42,24.61 13.9,24.61 13.5,25.01 13.5,26.31
D-: length 8.7
  Bottom Layer w0.2: 16.92,22.55 17.25,22.88 17.25,23.21 16.25,24.21 12.05,24.21 11.5,24.77 11.5,26.31
QSPI_SCLK: length 7.6
  Bottom Layer w0.2: 19.85,18.78 19.85,20.07 21.11,21.33 21.11,23.75 21.55,24.19 22.3,24.19 22.5,23.99 22.5,23.51
QSPI_SD0: length 5.5
  Bottom Layer w0.2: 22,23.51 22,23.29 21.51,22.8 21.51,21.13 20.25,19.87 20.25,18.78
QSPI_SD1: length 3.4
  Bottom Layer w0.2: 23,20.66 23,20.1 22.49,19.59 21.27,19.59 21.05,19.37 21.05,18.78
QSPI_SD2: length 3.4
  Bottom Layer w0.2: 20.65,18.78 20.65,19.54 21.1,19.99 22.32,19.99 22.5,20.16 22.5,20.66
QSPI_SD3: length 9
  Bottom Layer w0.2: 19.45,18.78 19.45,20.24 20.71,21.5 20.71,23.91 21.38,24.59 22.47,24.59 23,24.05 23,23.51
QSPI_SS: length 20.7
  Top Layer w0.2: v1(23.5,21.44) 24.35,20.59 v1(24.35,6.76)
  Bottom Layer w0.2: 21.45,18.78 21.46,18.79 22,18.79 22.25,19.04 23.24,19.04 23.5,19.3 U5.1 v1(23.5,21.44) ; 23.5,5.92 23.5,5.96 24.3,6.76 v1(24.35,6.76)
RTS1CTS: length 5.8
  Bottom Layer w0.2: 15.41,15.14 9.59,15.14
RX1TX: length 5.8
  Bottom Layer w0.2: 15.41,15.94 9.59,15.94
SWCLK: length 11.8
  Bottom Layer w0.2: 9.59,14.34 12.93,14.34 13.15,14.11 13.15,12.15 14.53,10.76 17.41,10.76 17.85,11.2 17.85,11.9
SWD: length 11.1
  Bottom Layer w0.2: 9.59,14.74 13.09,14.74 13.55,14.28 13.55,12.31 14.7,11.16 17.25,11.16 17.45,11.36 17.45,11.9
TX1RX: length 5.8
  Bottom Layer w0.2: 15.41,15.54 9.59,15.54
XIN: length 5.2
  Bottom Layer w0.2: 19.45,11.9 19.45,11.12 20.3,10.26 21.17,10.26 21.57,10.66 22.5,9.73 22.5,9.29
XOUT: length 2.5
  Bottom Layer w0.2: 19.75,9.67 19.75,10.25 19.05,10.95 19.05,11.9

## Copper pours and planes (outline as drawn; the poured copper is in the pictures)
+1V1 on Bottom Layer: 16.85,17.09 17.4,17.09 17.4,16.94 20.45,16.94 20.45,13.74 17.85,13.74 17.85,12.94 18.55,12.94 18.55,13.09 21.1,13.09 21.1,17.54 18.3,17.54 18.3,17.79 17.85,17.79 17.85,18.14 16.85,18.14
+1V2 on Bottom Layer: 8.15,14.39 7.6,14.39 7.6,14.54 4.55,14.54 4.55,17.74 7.15,17.74 7.15,18.54 6.45,18.54 6.45,18.39 3.9,18.39 3.9,13.94 6.7,13.94 6.7,13.69 7.15,13.69 7.15,13.34 8.15,13.34
+3V3 on Bottom Layer: 16.05,12.54 21.65,12.54 21.65,18.14 16.05,18.14
+3V3 on Bottom Layer: 8.95,18.94 3.35,18.94 3.35,13.34 8.95,13.34
GND on Top Layer: 0,37.67 25,37.67 25,0 0,0
GND on Bottom Layer: 0,37.67 25,37.67 25,0 0,0
